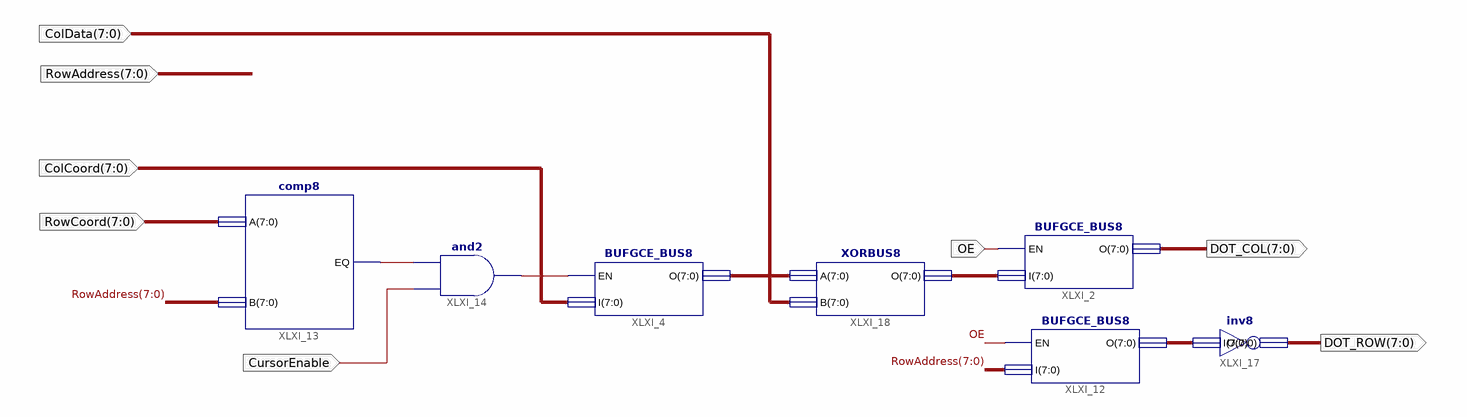
[diagram p0: schematic sheet 1]
// Xilinx ISE schematic OutputUnit.sch (spartan6) as structural Verilog: 7 symbols, 8 ports
module OutputUnit (
  input  [7:0] ColData,
  input  [7:0] ColCoord,
  input  CursorEnable,
  input  [7:0] RowAddress,
  input  [7:0] RowCoord,
  input  OE,
  output [7:0] DOT_COL,
  output [7:0] DOT_ROW
);

  wire XLXN_10, XLXN_40;
  wire [7:0] XLXN_4, XLXN_34, XLXN_45;

  BUFGCE_BUS8 XLXI_4 (.EN(XLXN_10), .I(ColCoord), .O(XLXN_34));
  BUFGCE_BUS8 XLXI_2 (.EN(OE), .I(XLXN_4), .O(DOT_COL));
  BUFGCE_BUS8 XLXI_12 (.EN(OE), .I(RowAddress), .O(XLXN_45));
  comp8 XLXI_13 (.A(RowCoord), .B(RowAddress), .EQ(XLXN_40));
  and XLXI_14 (XLXN_10, CursorEnable, XLXN_40);
  inv8 XLXI_17 (.I(XLXN_45), .O(DOT_ROW));
  XORBUS8 XLXI_18 (.A(XLXN_34), .B(ColData), .O(XLXN_4));
endmodule
